# EAGLE design slipringsch (EAGLE 8.4.2)
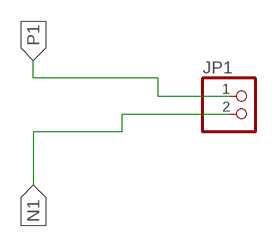
[diagram p0: schematic, sheet 1]

## Parts
JP1  PINHD-1X2M  [1X02M]

## Nets
N1: JP1.2
P1: JP1.1

## Library data of the parts
JP1 = pinhead:PINHD-1X2: PIN HEADER

## Board
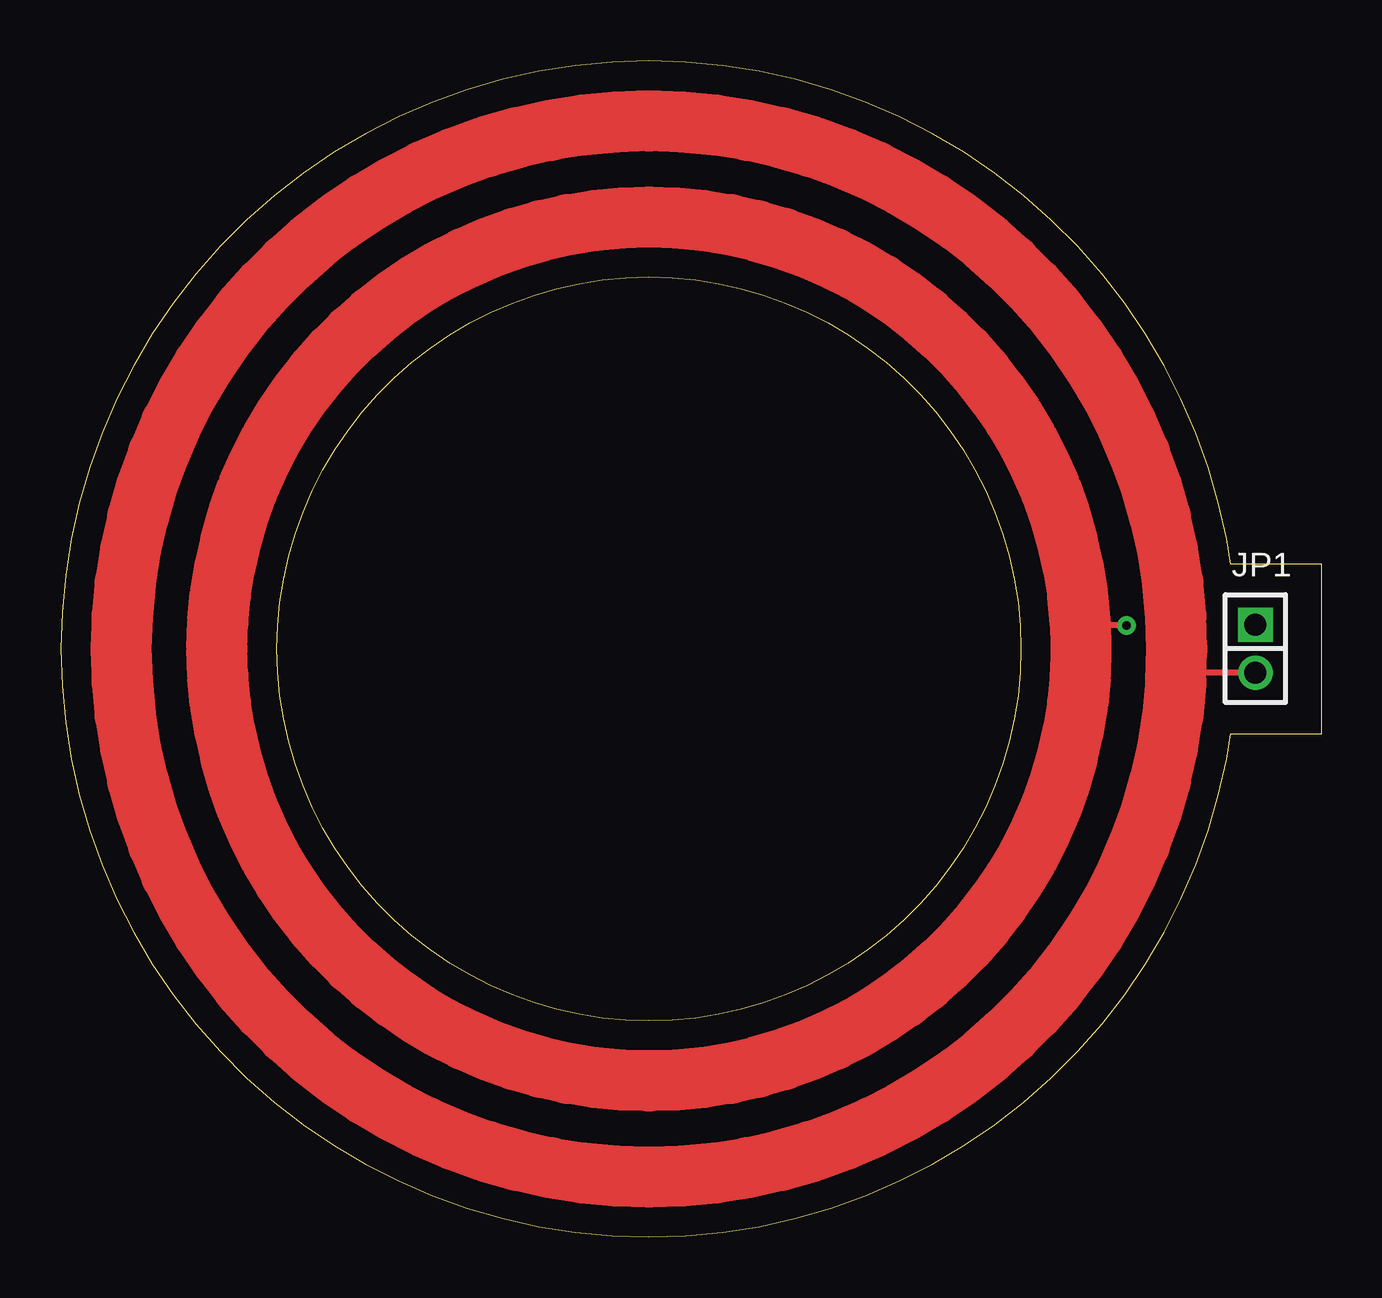
[diagram p1: board, top side]
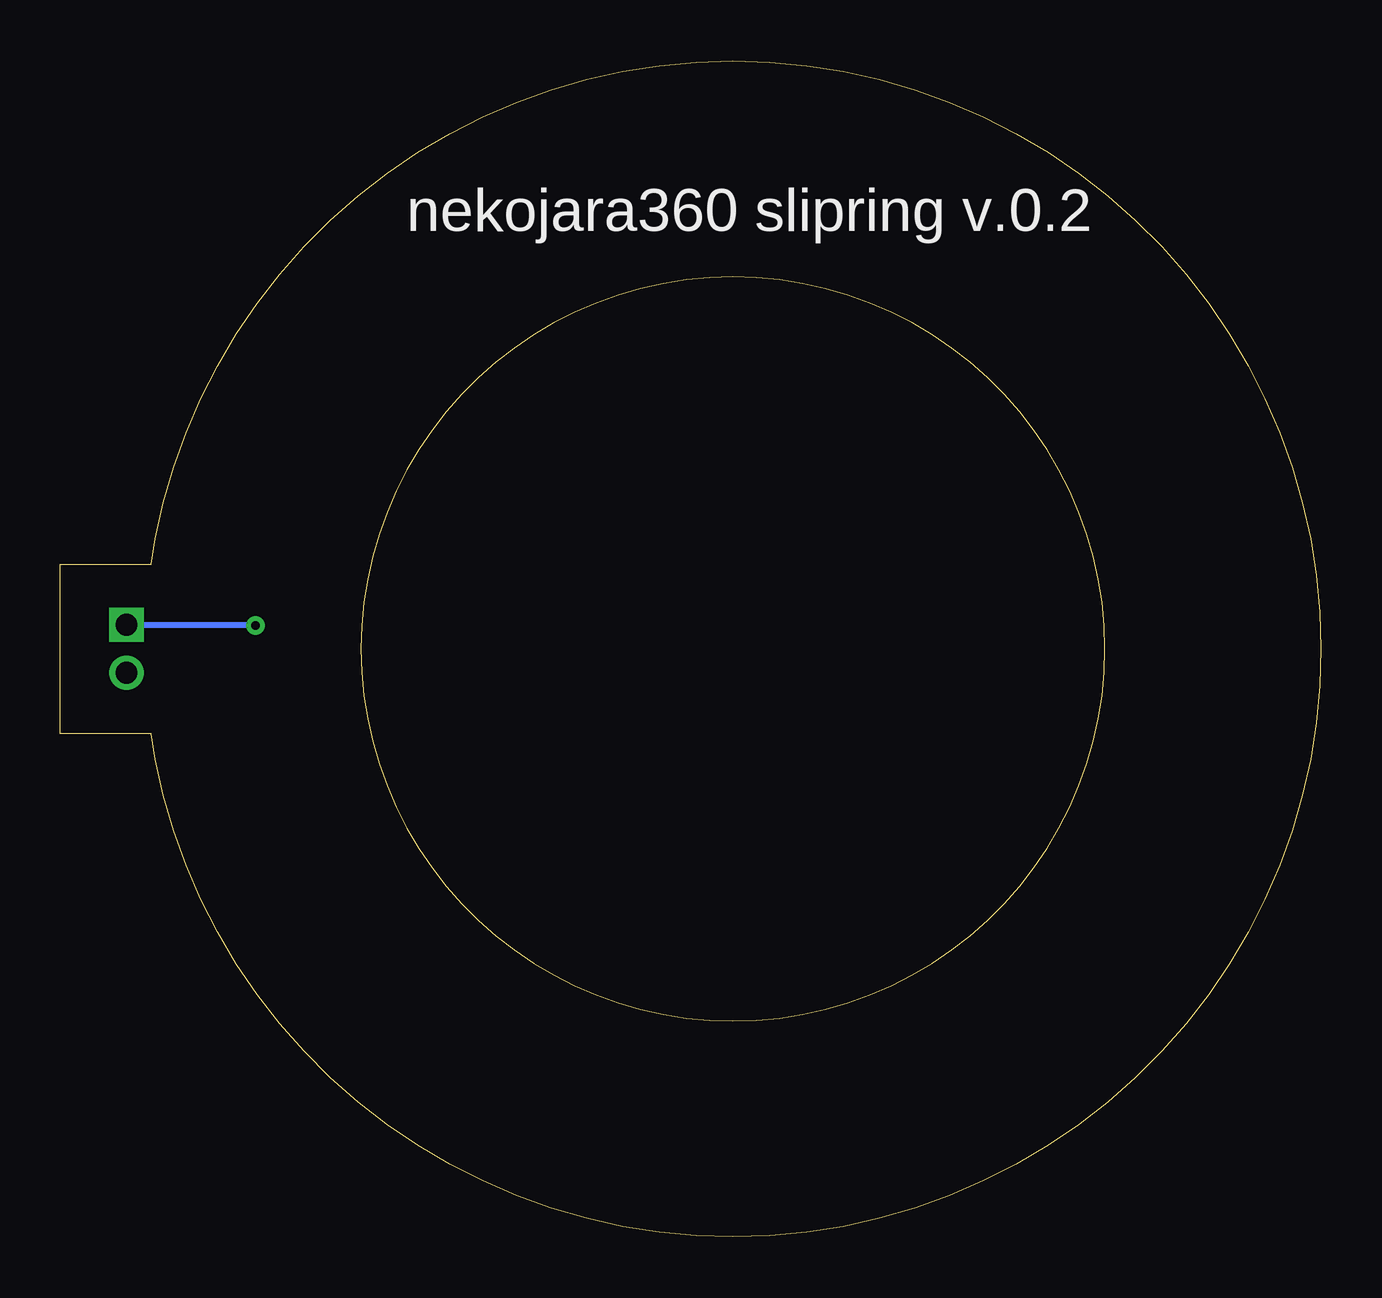
[diagram p2: board, bottom side, seen from below]

Size 52.54 x 49 mm. Coordinates in mm from the lower left corner, seen from the top.
Outline: 26.04,0.05 27.57,0.19 29.09,0.43 30.59,0.77 32.07,1.2 33.52,1.72 34.93,2.33 36.3,3.03 37.63,3.81 38.9,4.68 40.12,5.62 41.27,6.64 42.36,7.73 43.38,8.88 44.32,10.1 45.19,11.37 45.97,12.7 46.67,14.07 47.28,15.48 47.8,16.93 48.23,18.41 48.57,19.91 48.73,20.96 52.54,20.96 52.54,28.04 48.73,28.04 48.57,29.09 48.23,30.59 47.8,32.07 47.28,33.52 46.67,34.93 45.97,36.3 45.19,37.63 44.32,38.9 43.38,40.12 42.36,41.27 41.27,42.36 40.12,43.38 38.9,44.32 37.63,45.19 36.3,45.97 34.93,46.67 33.52,47.28 32.07,47.8 30.59,48.23 29.09,48.57 27.57,48.81 26.04,48.95 24.5,49 22.96,48.95 21.43,48.81 19.91,48.57 18.41,48.23 16.93,47.8 15.48,47.28 14.07,46.67 12.7,45.97 11.37,45.19 10.1,44.32 8.88,43.38 7.73,42.36 6.64,41.27 5.62,40.12 4.68,38.9 3.81,37.63 3.03,36.3 2.33,34.93 1.72,33.52 1.2,32.07 0.77,30.59 0.43,29.09 0.19,27.57 0.05,26.04 0,24.5 0.05,22.96 0.19,21.43 0.43,19.91 0.77,18.41 1.2,16.93 1.72,15.48 2.33,14.07 3.03,12.7 3.81,11.37 4.68,10.1 5.62,8.88 6.64,7.73 7.73,6.64 8.88,5.62 10.1,4.68 11.37,3.81 12.7,3.03 14.07,2.33 15.48,1.72 16.93,1.2 18.41,0.77 19.91,0.43 21.43,0.19 22.96,0.05 24.5,0 26.04,0.05
Outline: 23.53,9.03 22.56,9.12 21.6,9.28 20.64,9.49 19.71,9.76 18.79,10.09 17.9,10.47 17.03,10.92 16.2,11.41 15.39,11.96 14.62,12.56 13.89,13.2 13.2,13.89 12.56,14.62 11.96,15.39 11.41,16.2 10.92,17.03 10.47,17.9 10.09,18.79 9.76,19.71 9.49,20.64 9.28,21.6 9.12,22.56 9.03,23.53 9,24.5 9.03,25.47 9.12,26.44 9.28,27.4 9.49,28.36 9.76,29.29 10.09,30.21 10.47,31.1 10.92,31.97 11.41,32.8 11.96,33.61 12.56,34.38 13.2,35.11 13.89,35.8 14.62,36.44 15.39,37.04 16.2,37.59 17.03,38.08 17.9,38.52 18.79,38.91 19.71,39.24 20.64,39.51 21.6,39.73 22.56,39.88 23.53,39.97 24.5,40 25.47,39.97 26.44,39.88 27.4,39.73 28.36,39.51 29.29,39.24 30.21,38.91 31.1,38.52 31.97,38.08 32.8,37.59 33.61,37.04 34.38,36.44 35.11,35.8 35.8,35.11 36.44,34.38 37.04,33.61 37.59,32.8 38.08,31.97 38.52,31.1 38.91,30.21 39.24,29.29 39.51,28.36 39.73,27.4 39.88,26.44 39.97,25.47 40,24.5 39.97,23.53 39.88,22.56 39.73,21.6 39.51,20.64 39.24,19.71 38.91,18.79 38.52,17.9 38.08,17.03 37.59,16.2 37.04,15.39 36.44,14.62 35.8,13.89 35.11,13.2 34.38,12.56 33.61,11.96 32.8,11.41 31.97,10.92 31.1,10.47 30.21,10.09 29.29,9.76 28.36,9.49 27.4,9.28 26.44,9.12 25.47,9.03 24.5,9 23.53,9.03
Copper layers (1*16): Top 0.035mm / dielectric 1.5mm / Bottom 0.035mm
Design rules "default": minimum track width 6mil, minimum drill 0.35mm, track to track 6mil, track to pad 6mil, pad to pad 6mil, via to via 6mil, smd to smd 6mil, copper to edge 40mil, drill to drill 6mil, minimum pad ring 10mil, minimum via ring 8mil, stop-mask expansion 4mil, vias tented up to drill 0mil, thermal gap 10mil

### Footprints (pad centres in the part's own frame; a part is rotated, then mirrored left to right if it is on the bottom)
1X02M = drill 0.914 square: 1 -1,0 | drill 0.914: 2 1,0

### Placement (x,y rotation side)
JP1  49.77,24.51 270 top

### Tracks (layer width: path | path; a pad name or v marks a point on that pad's centre or on a via)
N1
  Top 0.254: JP1.2 46.85,23.51 46.46,23.12
  Top 2.54: 25.88,2.54 27.26,2.67 28.62,2.89 29.97,3.19 31.3,3.58 32.6,4.04 33.87,4.59 35.1,5.22 36.29,5.92 37.43,6.7 38.52,7.55 39.56,8.46 40.54,9.44 41.45,10.48 42.3,11.57 43.08,12.71 43.78,13.9 44.41,15.13 44.95,16.4 45.42,17.7 45.81,19.03 46.11,20.38 46.33,21.74 46.46,23.12 46.5,24.5 46.46,25.88 46.33,27.26 46.11,28.62 45.81,29.97 45.42,31.3 44.95,32.6 44.41,33.87 43.78,35.1 43.08,36.29 42.3,37.43 41.45,38.52 40.54,39.56 39.56,40.54 38.52,41.45 37.43,42.3 36.29,43.08 35.1,43.78 33.87,44.41 32.6,44.95 31.3,45.42 29.97,45.81 28.62,46.11 27.26,46.33 25.88,46.46 24.5,46.5 23.12,46.46 21.74,46.33 20.38,46.11 19.03,45.81 17.7,45.42 16.4,44.95 15.13,44.41 13.9,43.78 12.71,43.08 11.57,42.3 10.48,41.45 9.44,40.54 8.46,39.56 7.55,38.52 6.7,37.43 5.92,36.29 5.22,35.1 4.59,33.87 4.04,32.6 3.58,31.3 3.19,29.97 2.89,28.62 2.67,27.26 2.54,25.88 2.5,24.5 2.54,23.12 2.67,21.74 2.89,20.38 3.19,19.03 3.58,17.7 4.04,16.4 4.59,15.13 5.22,13.9 5.92,12.71 6.7,11.57 7.55,10.48 8.46,9.44 9.44,8.46 10.48,7.55 11.57,6.7 12.71,5.92 13.9,5.22 15.13,4.59 16.4,4.04 17.7,3.58 19.03,3.19 20.38,2.89 21.74,2.67 23.12,2.54 24.5,2.5 25.88,2.54
P1  (via drill 0.35)
  Top 0.254: v44.4,25.48 42.62,25.48 42.47,25.63
  Top 2.54: 23.37,6.54 22.24,6.64 21.13,6.82 20.02,7.07 18.94,7.38 17.87,7.76 16.84,8.21 15.83,8.73 14.86,9.3 13.92,9.94 13.03,10.63 12.18,11.38 11.38,12.18 10.63,13.03 9.94,13.92 9.3,14.86 8.73,15.83 8.21,16.84 7.76,17.87 7.38,18.94 7.07,20.02 6.82,21.13 6.64,22.24 6.54,23.37 6.5,24.5 6.54,25.63 6.64,26.76 6.82,27.87 7.07,28.98 7.38,30.06 7.76,31.13 8.21,32.16 8.73,33.17 9.3,34.15 9.94,35.08 10.63,35.97 11.38,36.82 12.18,37.62 13.03,38.37 13.92,39.06 14.86,39.7 15.83,40.27 16.84,40.79 17.87,41.24 18.94,41.62 20.02,41.93 21.13,42.18 22.24,42.36 23.37,42.47 24.5,42.5 25.63,42.47 26.76,42.36 27.87,42.18 28.98,41.93 30.06,41.62 31.13,41.24 32.16,40.79 33.17,40.27 34.15,39.7 35.08,39.06 35.97,38.37 36.82,37.62 37.62,36.82 38.37,35.97 39.06,35.08 39.7,34.15 40.27,33.17 40.79,32.16 41.24,31.13 41.62,30.06 41.93,28.98 42.18,27.87 42.36,26.76 42.47,25.63 42.5,24.5 42.47,23.37 42.36,22.24 42.18,21.13 41.93,20.02 41.62,18.94 41.24,17.87 40.79,16.84 40.27,15.83 39.7,14.86 39.06,13.92 38.37,13.03 37.62,12.18 36.82,11.38 35.97,10.63 35.08,9.94 34.15,9.3 33.17,8.73 32.16,8.21 31.13,7.76 30.06,7.38 28.98,7.07 27.87,6.82 26.76,6.64 25.63,6.54 24.5,6.5 23.37,6.54
  Bottom 0.254: 44.45,25.53 44.48,25.53 v44.4,25.48 44.43,25.51 JP1.1

### Text on the board
bPlace: nekojara360 slipring v.0.2